# Altium schematic sheet MP3 Player.SchDoc
size A3
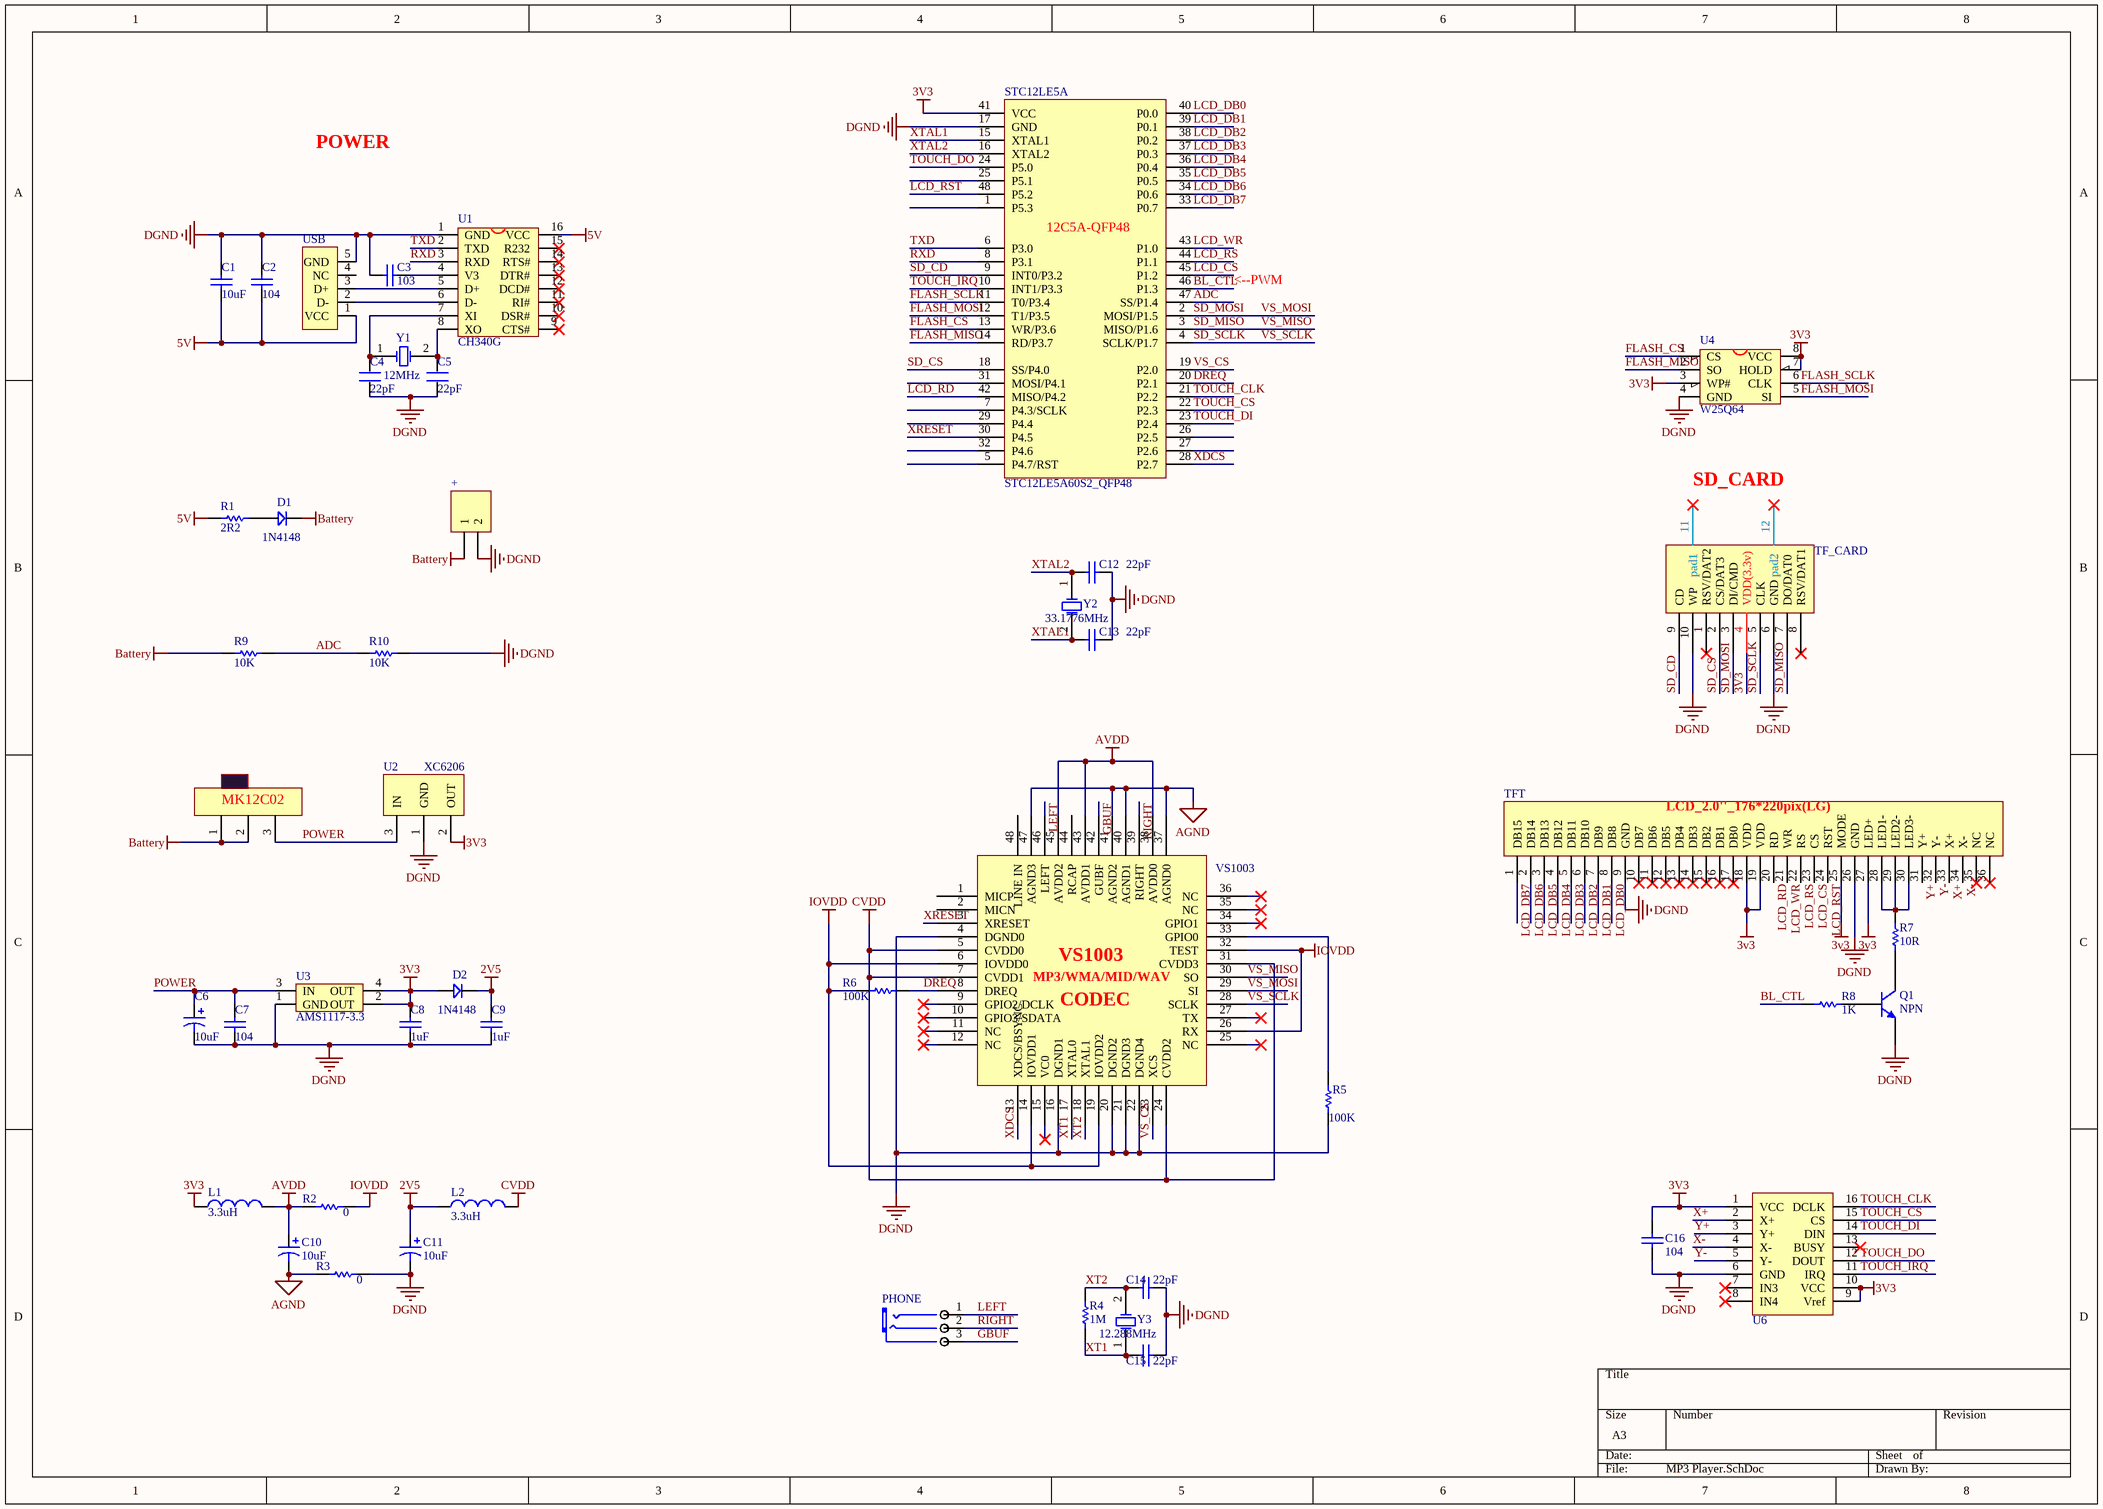
[diagram p0: MP3 Player.SchDoc]

## Parts
+  Header 2  [HDR1X2]  (value not drawn)
?  MK12C02(拨动开关)  [MK12C02(拨动开关)]  (value not drawn)
C1  value 10uF  [C0805]  (hidden comment: Cap_NonPol)
C2  value 104  [C0805]  (hidden comment: Cap_NonPol)
C3  value 103  [C0805]  (hidden comment: Cap_NonPol)
C4  22pF  [C0805]
C5  22pF  [C0805]
C6  value 10uF  [2012[0805]]  (hidden comment: Cap_Pol2)
C7  value 104  [C0805]  (hidden comment: Cap_NonPol)
C8  value 1uF  [C0805]  (hidden comment: Cap_NonPol)
C9  value 1uF  [C0805]  (hidden comment: Cap_NonPol)
C10  value 10uF  [C0805]  (hidden comment: Cap_Pol2)
C11  value 10uF  [C0805]  (hidden comment: Cap_Pol2)
C12  value 22pF  [C0805]  (hidden comment: Cap_NonPol)
C13  value 22pF  [C0805]  (hidden comment: Cap_NonPol)
C14  value 22pF  [C0805]  (hidden comment: Cap_NonPol)
C15  value 22pF  [C0805]  (hidden comment: Cap_NonPol)
C16  value 104  [C0805]  (hidden comment: Cap_NonPol)
D1  1N4148  [DIODE_SOP]
D2  1N4148  [DIODE_SOP]
L1  value 3.3uH  [2012[0805]]  (hidden comment: Inductor)
L2  value 3.3uH  [2012[0805]]  (hidden comment: Inductor)
PHONE  PHONE_M  [PHONE_ST]  (value not drawn)
Q1  NPN  [SOT-23]
R1  value 2R2  [2012[0805]]  (hidden comment: Res)
R2  value 0  [2012[0805]]  (hidden comment: Res)
R3  value 0  [2012[0805]]  (hidden comment: Res)
R4  value 1M  [2012[0805]]  (hidden comment: Res)
R5  value 100K  [2012[0805]]  (hidden comment: Res)
R6  value 100K  [2012[0805]]  (hidden comment: Res Semi)
R7  value 10R  [2012[0805]]  (hidden comment: Res)
R8  value 1K  [2012[0805]]  (hidden comment: Res)
R9  value 10K  [2012[0805]]  (hidden comment: Res)
R10  value 10K  [2012[0805]]  (hidden comment: Res)
STC12LE5A  STC12LE5A60S2_QFP48  [VS1003]
TF_CARD  SD卡  [microSD_ZISUO]  (value not drawn)
TFT  LCD_176*220_2.0''(LG)  [LCD_2.0''_176*220pix(LG4525)]  (value not drawn)
U1  CH340G  [SOP16M]
U2  XC6206  [SOT-23]
U3  AMS1117-3.3  [AMS1117]
U4  W25Q64  [SOIC-8]
U6  AD7843  [TSSOP16]  (value not drawn)
USB  USB  [USB/SM0.8-6H5]  (value not drawn)
VS1003  VS1003  [VS1003]  (value not drawn)
Y1  12MHz  [XTAL_US]
Y2  33.1776MHz  [XTAL_US]
Y3  12.288MHz  [XTAL_US]

## Nets
2V5: C9.2 C11.1 D2.2 L2.1
3V3: C8.2 C16.2 D2.1 L1.1 STC12LE5A.41(VCC) TF_CARD.4(VDD(3.3v)) TFT.18(VDD) TFT.19(VDD) TFT.25(MODE) TFT.27(LED+) U2.2(OUT) U3.2(OUT) U3.4(OUT) U4.3(WP#) U4.7(HOLD) U4.8(VCC) U6.1(VCC) U6.9(Vref) U6.10(VCC)
5V: C1.1 C2.1 R1.2 U1.16(VCC) USB.1(VCC)
AGND: C10.2 R3.1 VS1003.37(AGND0) VS1003.40(AGND1) VS1003.41(AGND2) VS1003.47(AGND3)
AVDD: C10.1 L1.2 R2.1 VS1003.38(AVDD0) VS1003.43(AVDD1) VS1003.45(AVDD2)
Battery: +.1 ?.1 ?.2 D1.2 R9.1
CVDD: L2.2 VS1003.5(CVDD0) VS1003.7(CVDD1) VS1003.24(CVDD2) VS1003.31(CVDD3)
DGND: +.2 C1.2 C2.2 C3.1 C4.1 C5.1 C6.2 C7.1 C8.1 C9.1 C11.2 C12.1 C13.1 C14.1 C15.1 C16.1 Q1.2(E) R3.2 R5.1 R10.2 STC12LE5A.17(GND) TF_CARD.6(GND) TF_CARD.10(WP) TFT.9(GND) TFT.26(GND) U1.1(GND) U2.1(GND) U3.1(GND) U4.4(GND) U6.6(GND) USB.5(GND) VS1003.4(DGND0) VS1003.16(DGND1) VS1003.20(DGND2) VS1003.21(DGND3) VS1003.22(DGND4)
IOVDD: R2.2 R6.1 VS1003.6(IOVDD0) VS1003.14(IOVDD1) VS1003.19(IOVDD2) VS1003.26(RX) VS1003.32(TEST)
ADC: R9.2 R10.1 STC12LE5A.47(SS/P1.4)
BL_CTL: R8.1 STC12LE5A.46(P1.3)
DREQ: R6.2 STC12LE5A.20(P2.1) VS1003.8(DREQ)
FLASH_CS: STC12LE5A.13(WR/P3.6) U4.1(CS)
FLASH_MISO: STC12LE5A.14(RD/P3.7) U4.2(SO)
FLASH_MOSI: STC12LE5A.12(T1/P3.5) U4.5(SI)
FLASH_SCLK: STC12LE5A.11(T0/P3.4) U4.6(CLK)
GBUF: PHONE.3(COM) VS1003.42(GUBF)
LCD_CS: STC12LE5A.45(P1.2) TFT.23(CS)
LCD_DB0: STC12LE5A.40(P0.0) TFT.8(DB8)
LCD_DB1: STC12LE5A.39(P0.1) TFT.7(DB9)
LCD_DB2: STC12LE5A.38(P0.2) TFT.6(DB10)
LCD_DB3: STC12LE5A.37(P0.3) TFT.5(DB11)
LCD_DB4: STC12LE5A.36(P0.4) TFT.4(DB12)
LCD_DB5: STC12LE5A.35(P0.5) TFT.3(DB13)
LCD_DB6: STC12LE5A.34(P0.6) TFT.2(DB14)
LCD_DB7: STC12LE5A.33(P0.7) TFT.1(DB15)
LCD_RD: STC12LE5A.42(MISO/P4.2) TFT.20(RD)
LCD_RS: STC12LE5A.44(P1.1) TFT.22(RS)
LCD_RST: STC12LE5A.48(P5.2) TFT.24(RST)
LCD_WR: STC12LE5A.43(P1.0) TFT.21(WR)
LEFT: PHONE.1(CHL) VS1003.46(LEFT)
POWER: ?.3 C6.1 C7.2 U2.3(IN) U3.3(IN)
RIGHT: PHONE.2(CHR) VS1003.39(RIGHT)
RXD: STC12LE5A.8(P3.1) U1.3(RXD)
SD_CD: STC12LE5A.9(INT0/P3.2) TF_CARD.9(CD)
SD_CS: STC12LE5A.18(SS/P4.0) TF_CARD.2(CS/DAT3)
SD_MISO: STC12LE5A.3(MISO/P1.6) TF_CARD.7(DO/DAT0) VS1003.30(SO)  [also labelled VS_MISO]
SD_MOSI: STC12LE5A.2(MOSI/P1.5) TF_CARD.3(DI/CMD) VS1003.29(SI)  [also labelled VS_MOSI]
SD_SCLK: STC12LE5A.4(SCLK/P1.7) TF_CARD.5(CLK) VS1003.28(SCLK)  [also labelled VS_SCLK]
TOUCH_CLK: STC12LE5A.21(P2.2) U6.16(DCLK)
TOUCH_CS: STC12LE5A.22(P2.3) U6.15(CS)
TOUCH_DI: STC12LE5A.23(P2.4) U6.14(DIN)
TOUCH_DO: STC12LE5A.24(P5.0) U6.12(DOUT)
TOUCH_IRQ: STC12LE5A.10(INT1/P3.3) U6.11(IRQ)
TXD: STC12LE5A.6(P3.0) U1.2(TXD)
VS_CS: STC12LE5A.19(P2.0) VS1003.23(XCS)
X+: TFT.33(X+) U6.2(X+)
X-: TFT.34(X-) U6.4(X-)
XDCS: STC12LE5A.28(P2.7) VS1003.13(XDCS/BSYNC)
XRESET: STC12LE5A.30(P4.5) VS1003.3(XRESET)
XT1: C15.2 R4.1 VS1003.17(XTAL0) Y3.1(OSC1)
XT2: C14.2 R4.2 VS1003.18(XTAL1) Y3.2(OSC2)
XTAL1: C13.2 STC12LE5A.15(XTAL1) Y2.2(OSC2)
XTAL2: C12.2 STC12LE5A.16(XTAL2) Y2.1(OSC1)
Y+: TFT.31(Y+) U6.3(Y+)
Y-: TFT.32(Y-) U6.5(Y-)
NetC3_2: C3.2 U1.4(V3)
NetC4_2: C4.2 U1.7(XI) Y1.1(OSC1)
NetC5_2: C5.2 U1.8(XO) Y1.2(OSC2)
NetD1_1: D1.1 R1.1
NetQ1_1: Q1.1(B) R8.2
NetQ1_3: Q1.3(C) R7.1
NetR5_2: R5.2 VS1003.33(GPIO0)
NetR7_2: R7.2 TFT.28(LED1-) TFT.29(LED2-) TFT.30(LED3-)
NetU1_5: U1.5(D+) USB.3(D+)
NetU1_6: U1.6(D-) USB.2(D-)

Not connected (* = marked no-connect by the designer): STC12LE5A 1(P5.3) 5(P4.7/RST) 7(P4.3/SCLK) 25(P5.1) 26(P2.5) 27(P2.6) 29(P4.4) 31(MOSI/P4.1) 32(P4.6); TF_CARD 1(RSV/DAT2)* 8(RSV/DAT1)* 11(pad1)* 12(pad2)*; TFT 10(DB7)* 11(DB6)* 12(DB5)* 13(DB4)* 14(DB3)* 15(DB2)* 16(DB1)* 17(DB0)* 35(NC)* 36(NC)*; U1 9(CTS#)* 10(DSR#)* 11(RI#)* 12(DCD#)* 13(DTR#)* 14(RTS#)* 15(R232)*; U6 7(IN3)* 8(IN4)* 13(BUSY)*; USB 4(NC); VS1003 1(MICP) 2(MICN) 9(GPIO2/DCLK)* 10(GPIO3/SDATA)* 11(NC)* 12(NC)* 15(VC0)* 25(NC)* 27(TX)* 34(GPIO1)* 35(NC)* 36(NC)* 44(RCAP) 48(LINE_IN)

## Notes on the sheet
- POWER
- <--PWM
- SD_CARD
- (in symbol 12C5A60S2_QFP48) 12C5A-QFP48
- (in symbol LCD_176*220_2.0''(LG)) LCD_2.0''_176*220pix(LG)
- (in symbol MK12C02(拨动开关)) MK12C02
- (in symbol VS1003) MP3/WMA/MID/WAV; CODEC

## Library data of the parts
+ = Header 2: Header, 2-Pin; LatestRevisionDate: 17-Jul-2002; LatestRevisionNote: Re-released for DXP Platform.; Publisher: Altium Limited
C1-C3 C7-C9 C12-C16 = Cap_NonPol: Capacitor (Semiconductor SIM Model); Published: 8-Jun-2000; LatestRevisionDate: 17-Jul-2002; LatestRevisionNote: Re-released for DXP Platform.; PackageReference: C1206; Publisher: Altium Limited
C4 C5 = C
C6 C10 C11 = Cap_Pol2: Polarized Capacitor (Axial); Published: 8-Jun-2000; LatestRevisionDate: 17-Jul-2002; LatestRevisionNote: Re-released for DXP Platform.; PackageReference: POLAR0.8; Publisher: Altium Limited
D1 D2 = D
L1 L2 = Inductor: Code_IEC: 1005; Published: 8-Jun-2000; LatestRevisionDate: 17-Jul-2002; LatestRevisionNote: Re-released for DXP Platform.; PackageReference: 0402-A; Publisher: Altium Limited; Code_JEITA: 0402
Q1 = NPN: NPN Bipolar Transistor; Published: 8-Jun-2000; LatestRevisionDate: 17-Jul-2002; LatestRevisionNote: Re-released for DXP Platform.; PackageReference: TO-226; Publisher: Altium Limited; Code_JEDEC: TO-226-AA
R1-R5 R7-R10 = Res: Semiconductor Resistor; Published: 8-Jun-2000; LatestRevisionDate: 17-Jul-2002; LatestRevisionNote: Re-released for DXP Platform.; PackageReference: AXIAL-0.5; Publisher: Altium Limited
R6 = Res Semi: Semiconductor Resistor; Published: 8-Jun-2000; LatestRevisionDate: 17-Jul-2002; LatestRevisionNote: Re-released for DXP Platform.; PackageReference: AXIAL-0.5; Publisher: Altium Limited
STC12LE5A = 12C5A60S2_QFP48
TFT = LCD_176*220_2.0''(LG): LCD_176*220_2.0''
U1 = CH340G: USB2UART
U3 = AMS1117
U4 = W25X16: W25X16;SST25VF016;MX25L1605
U6 = AD7843: TOUCH_AD7843
USB = USB5
Y1-Y3 = XTAL: Crystal Oscillator; Published: 8-Jun-2000; LatestRevisionDate: 17-Jul-2002; LatestRevisionNote: Re-released for DXP Platform.; PackageReference: R38; Publisher: Altium Limited